# Altium project Sensors_and_MCU.PrjPcb
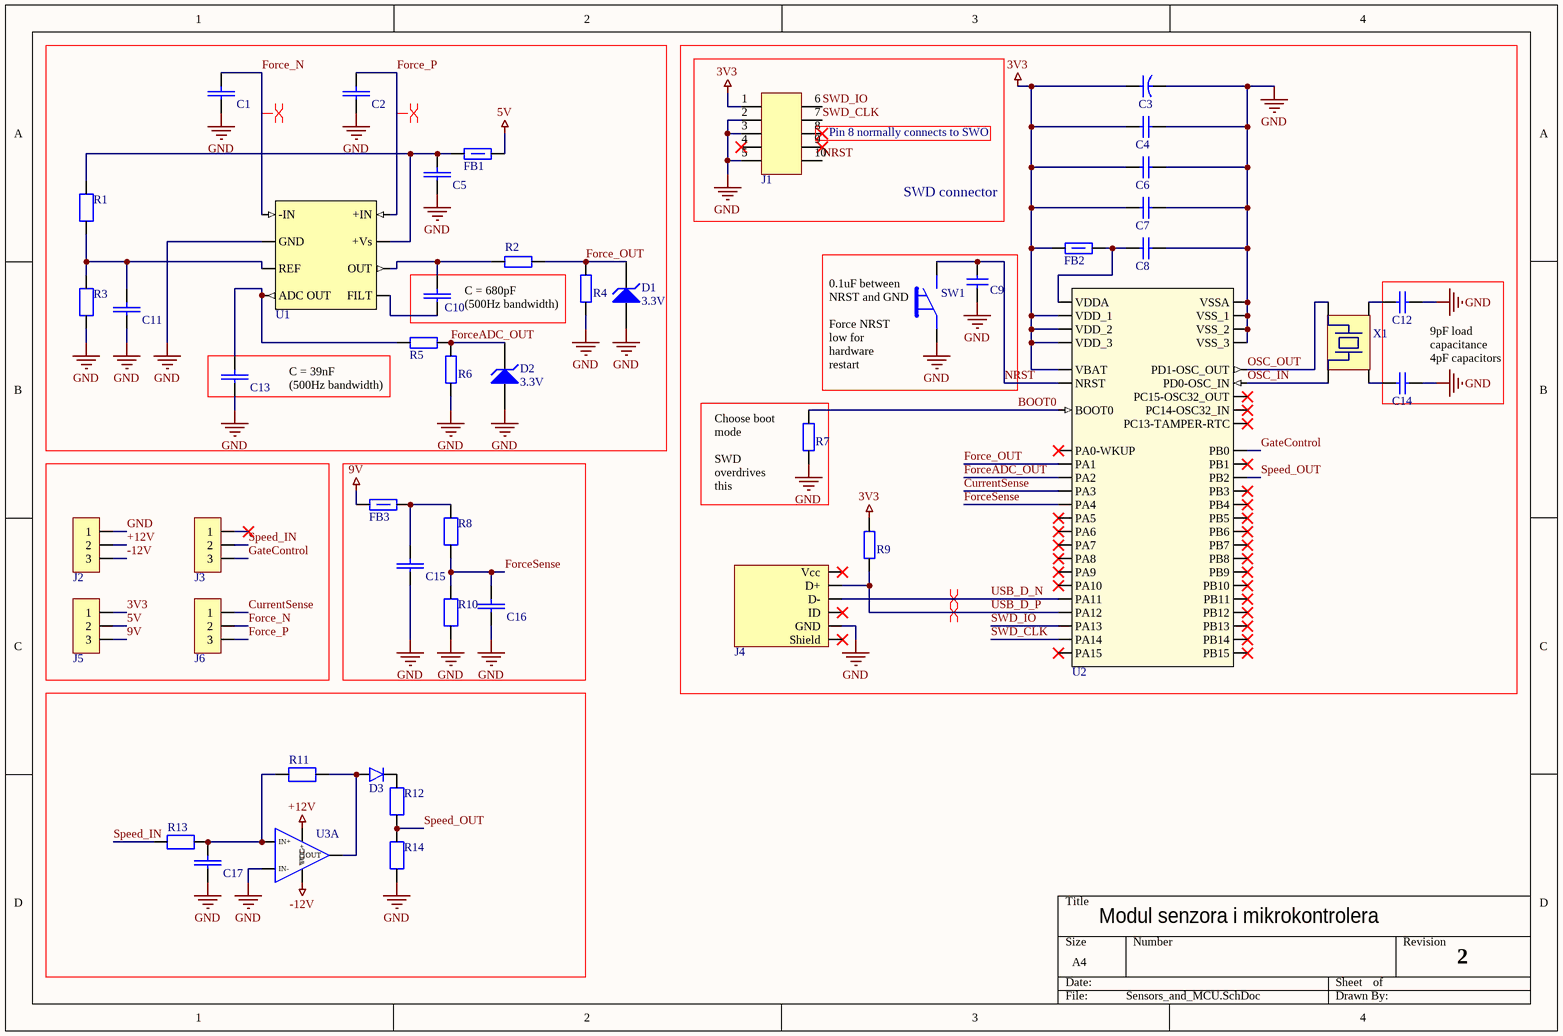
[diagram p0: Sensors_and_MCU.SchDoc]
1 sheet, 48 parts. Net scope: global (net labels, ports and power ports of the same name join across sheets).
Board file: Sensors_and_MCU.PcbDoc

## Sheet Sensors_and_MCU.SchDoc
size A4; SheetNumber: 1; SheetTotal: 1

### Parts
C1  Capacitor-NP  [C-NP]  (value not drawn)
C2  Capacitor-NP  [C-NP]  (value not drawn)
C3  10uF  [CAPAE430X610D540L170X65N]  (value not drawn)
C4  100nF  [CAPC160X80X87L35N]  (value not drawn)
C5  Capacitor-NP  [C-NP]  (value not drawn)
C6  100nF  [CAPC160X80X87L35N]  (value not drawn)
C7  100nF  [CAPC160X80X87L35N]  (value not drawn)
C8  100nF  [CAPC160X80X87L35N]  (value not drawn)
C9  100nF  [CAPC160X80X87L35N]  (value not drawn)
C10  Capacitor-NP  [C-NP]  (value not drawn)
C11  Capacitor-NP  [C-NP]  (value not drawn)
C12  4pF  [CAPC100X50X55L22N]  (value not drawn)
C13  Capacitor-NP  [C-NP]  (value not drawn)
C14  4pF  [CAPC100X50X55L22N]  (value not drawn)
C15  Capacitor-NP  [C-NP]  (value not drawn)
C16  Capacitor-NP  [C-NP]  (value not drawn)
C17  Capacitor-NP  [C-NP]  (value not drawn)
D1  BV: 3.3V  (hidden comment: Zener Diode)
D2  BV: 3.3V  (hidden comment: Zener Diode)
D3  Diode  [Diode]  (value not drawn)
FB1  BLM18HE152SH1D  [BEADC160X80X95L30N]  (value not drawn)
FB2  BLM18HE152SH1D  [BEADC160X80X95L30N]  (value not drawn)
FB3  BLM18HE152SH1D  [BEADC160X80X95L30N]  (value not drawn)
J1  Header_10P  [M50-3610542]  (value not drawn)
J2  Molex Micro-Latch  [ScrewTerminal]  (value not drawn)
J3  Molex Micro-Latch  [ScrewTerminal]  (value not drawn)
J4  USB  [USB_mini]  (value not drawn)
J5  Molex Micro-Latch  [ScrewTerminal]  (value not drawn)
J6  Molex Micro-Latch  [ScrewTerminal]  (value not drawn)
R1  100k  [R-2W]  (value not drawn)
R2  1.5k  [RESC160X80X50L30N]  (value not drawn)
R3  47k  [R-2W]  (value not drawn)
R4  1.5k  [RESC160X80X50L30N]  (value not drawn)
R5  1.5k  [RESC160X80X50L30N]  (value not drawn)
R6  1.5k  [RESC160X80X50L30N]  (value not drawn)
R7  1.5k  [RESC160X80X50L30N]  (value not drawn)
R8  200k  [R-2W]  (value not drawn)
R9  1.5k  [RESC160X80X50L30N]  (value not drawn)
R10  100k  [R-2W]  (value not drawn)
R11  220k  [R-2W]  (value not drawn)
R12  10k  [R-2W]  (value not drawn)
R13  1k  [R-2W]  (value not drawn)
R14  3.3k  [R-2W]  (value not drawn)
SW1  DTSM-62N-V-T/R  [DTSM62]  (value not drawn)
U1  AD8293G160ARJZ  [SOT23-8P65_280X145L45X30N]  (value not drawn)
U2  STM32F103CB  [QFP48P50_900X900X160L60X22N]  (value not drawn)
U3  RC4558P  [DIP1092W45P254L959H508Q8]  (value not drawn)  (part A of 2)
X1  16 MHz  [OSCCC320X250X60L90X110N]  (value not drawn)

### Blocks framed on the sheet
Pin 8 normally connects to SWO: C3 C4 C6-C9 C12 C14 FB2 J4 R7 R9 SW1 U2 X1
SWD connector: J1

### Nets
3V3: C3.1 C4.2 C6.2 C7.2 FB2.1 J1.1 J5.1 R9.2 U2.1(VBAT) U2.24(VDD_1) U2.36(VDD_2) U2.48(VDD_3)
5V: FB1.2 J5.2
9V: FB3.1 J5.3
+12V: J2.2 U3.8(VCC+)
-12V: J2.3 U3.4(VCC-)
GND: C1.1 C2.1 C3.2 C4.1 C5.1 C6.1 C7.1 C8.1 C9.2 C11.1 C12.1 C13.1 C14.1 C15.1 C16.1 C17.1 D1.1(A) D2.1(A) J1.2 J1.3 J1.5 J2.1 J4.5(GND) R3.1 R4.2 R6.2 R7.1 R10.1 R14.1 SW1.1 U1.2(GND) U2.8(VSSA) U2.23(VSS_1) U2.35(VSS_2) U2.47(VSS_3) U3.2(IN-)
BOOT0: R7.2 U2.44(BOOT0)
CurrentSense: J6.1 U2.13(PA3)
Force_N: C1.2 J6.2 U1.1(-IN)
Force_OUT: D1.2(K) R2.1 R4.1 U2.11(PA1)
Force_P: C2.2 J6.3 U1.8(+IN)
ForceADC_OUT: D2.2(K) R5.1 R6.1 U2.12(PA2)
ForceSense: C16.2 R8.1 R10.2 U2.14(PA4)
GateControl: J3.3 U2.18(PB0)
NRST: C9.1 J1.10 SW1.2 U2.7(NRST)
OSC_IN: U2.5(PD0-OSC_IN) X1.3
OSC_OUT: U2.6(PD1-OSC_OUT) X1.1
Speed_IN: J3.2 R13.2
Speed_OUT: R12.1 R14.2 U2.20(PB2)
SWD_CLK: J1.7 U2.37(PA14)
SWD_IO: J1.6 U2.34(PA13)
USB_D_N: J4.2(D-) U2.32(PA11)
USB_D_P: J4.3(D+) R9.1 U2.33(PA12)
NetC5_2: C5.2 FB1.1 R1.2 U1.7(+Vs)
NetC8_2: C8.2 FB2.2 U2.9(VDDA)
NetC10_1: C10.1 U1.5(FILT)
NetC10_2: C10.2 R2.2 U1.6(OUT)
NetC11_2: C11.2 R1.1 R3.2 U1.3(REF)
NetC12_2: C12.2 X1.2
NetC13_2: C13.2 R5.2 U1.4(ADC_OUT)
NetC14_2: C14.2 X1.4
NetC15_2: C15.2 FB3.2 R8.2
NetC17_2: C17.2 R11.2 R13.1 U3.3(IN+)
NetD3_A: D3.A R11.1 U3.1(OUT)
NetD3_C: D3.C R12.2

Not connected (* = marked no-connect by the designer): J1 4* 8* 9*; J3 1*; J4 1(Vcc)* 4(ID)* 6(Shield)*; U2 2(PC13-TAMPER-RTC)* 3(PC14-OSC32_IN)* 4(PC15-OSC32_OUT)* 10(PA0-WKUP)* 15(PA5)* 16(PA6)* 17(PA7)* 19(PB1)* 21(PB10)* 22(PB11)* 25(PB12)* 26(PB13)* 27(PB14)* 28(PB15)* 29(PA8)* 30(PA9)* 31(PA10)* 38(PA15)* 39(PB3)* 40(PB4)* 41(PB5)* 42(PB6)* 43(PB7)* 45(PB8)* 46(PB9)*

### Layout directives
differential pair: Force_N, Force_P, USB_D_N, USB_D_P

### Notes on the sheet
- C = 680pF
  (500Hz bandwidth)
- (near SW1) 0.1uF between NRST and GND
- (near R5) C = 39nF
  (500Hz bandwidth)
- (near SW1) Force NRST low for hardware restart
- 9pF load capacitance
  4pF capacitors
- (near R7) Choose boot mode
  SWD overdrives this
- Modul senzora i mikrokontrolera
- 2

### Library data of the parts
C1 C2 C11 C17 = Capacitor-NP: Value: 5nF
C3 = C_10uF_50V: Manufacturer Part Number: EEE-FK1H100SR; Voltage Rating: 50V; Capacitor Case Style: B; ComponentLinkDescription: Datasheet; FR_SN: C_P-01; Part Number: C_10uF_50V; Value: 10uF; ComponentLinkURL: https://hr.mouser.com/datasheet/2/315/ABA0000C1251-1138508.pdf; Supplier Part Number: 667-EEE-FK1H100SR
C4 C6-C9 = C_0603_100nF_50V: Manufacturer Part Number: CC0603MRY5V9BB104; Voltage Rating: 50V; Capacitor Case Style: 0603; ComponentLinkDescription: Datasheet; FR_SN: C_NP-02; Part Number: C_0603_100nF_50V; Value: 100nF; ComponentLinkURL: https://hr.mouser.com/datasheet/2/212/KEM_C1027_X7; Supplier Part Number: 603-C0603MRY5V9BB104
C5 C15 C16 = Capacitor-NP: Value: 100nF
C10 = Capacitor-NP: Value: 680pF
C12 C14 = C_0402_4pF_25V: Manufacturer Part Number: GRM0225C1E4R0CA03L; Voltage Rating: 25V; Capacitor Case Style: 0402; ComponentLinkDescription: Datasheet; FR_SN: C_NP-69; Part Number: C_0402_4pF_25V; Value: 4pF; ComponentLinkURL: https://hr.mouser.com/datasheet/2/281/GRM0225C1E4R; Supplier Part Number: 81-GRM0225C1E4R0CA3L
C13 = Capacitor-NP: Value: 39nF
D1 D2 = Zener Diode: AF: 1; BV_MAX: 1e99; CJO: 0; EG: 1.11; FC: 0.5; IBV: 0.001; IS: 1e-14; MJSW: 0.33; NTUN: 30; TNOM: 27; XTI: 3; SimulationGenericComponent: True; CJP: 0; CTA: 0; CTP: 0; FCS: 0.5; FV_MAX: 1e99; IKF: 0; IKR: 0; ISR: 1e-14; JSW: 0; JTUN: 0; JTUNSW: 0; KEG: 1; KF: 0; LEVEL: 1; N: 1; NBV: 1; NR: 1; NS: 1; PHP: 1; RS: 0; TCV: 0; TLEV: 0; TLEVC: 0; TM1: 0; TM2: 0; TPB: 0; TPHP: 0; TRS: 0; TRS2: 0; TT: 0; TTT1: 0; TTT2: 0; VJ: 1; XTITUN: 3
FB1-FB3 = BLM18HE152SH1D: DC Current Rating: 500 mA; Inductor Case Style: 0603; ComponentLinkDescription: Datasheet; FR_SN: FB-04; Part Number: BLM18HE152SH1D; Value: BLM18HE152SH1D; Manufacturer Part Number: BLM18HE152SH1D; ComponentLinkURL: https://hr.mouser.com/datasheet/2/281/QNFA9104-1915632.pdf; Supplier Part Number: 81-BLM18HE152SH1D
J1 = Header_2x5: ComponentLinkDescription: Datasheet; FR_SN: J-18; Part Number: Header_2x5; Value: Header_10P; Manufacturer Part Number: M50-3610542; ComponentLinkURL: https://hr.mouser.com/datasheet/2/181/M50-361-888037.pdf; Supplier Part Number: 855-M50-3610542
J2 J3 J5 J6 = Molex Micro-Latch 1x3: Manufacturer Part Number: 53254-0370; ComponentLinkDescription: Datasheet; FR_SN: J-13; Part Number: Molex Micro-Latch 1x3; Value: Molex Micro-Latch; ComponentLinkURL: https://hr.mouser.com/datasheet/2/276/0532540370_PCB_HEADERS-171041.pdf; Supplier Part Number: 538-53254-0370
J4 = USB mini: Manufacturer Part Number: UJ2-MBH-1-SMT-TR; ComponentLinkDescription: Datasheet; FR_SN: J-03; Part Number: USB mini; Value: USB; ComponentLinkURL: https://hr.mouser.com/datasheet/2/670/uj2-mbh-smt-1313286.pdf; Supplier Part Number: 490-UJ2-MBH-1-SMT
R1 R3 R8 R10-R14 = Resistor
  R1 R10: Value: 100k
  R3: Value: 47k
  R8: Value: 200k
  R11: Value: 220k
  R12: Value: 10k
  R13: Value: 1k
  R14: Value: 3.3k
R2 R4-R7 R9 = R_0603_1k5_0W1: Manufacturer Part Number: RT0603FRE101K5L; Power Rating: 100mW; Resistor Case Style: 0603; Temperature Coefficient: 50 PPM / C; FR_SN: R-118; Part Number: R_0603_1k5_0W1; Value: 1.5k; ComponentLink1URL: https://hr.mouser.com/datasheet/2/447/PYu_RT_1_to_0_01_RoHS_L_12-3003070.pdf; ComponentLink1Description: Datasheet; Supplier Part Number: 603-RT0603FRE101K5L
SW1 = DTSM-62N-V-T/R: Switch Case Style: SMD; Configuration: SPST; ComponentLinkDescription: Datasheet; FR_SN: SW-12; Part Number: DTSM-62N-V-T/R; Value: DTSM-62N-V-T/R; Type: Tactile Switch; Manufacturer Part Number: DTSM-62N-V-T/R; ComponentLinkURL: https://www.mouser.com/datasheet/2/910/464_DTSMJ_6-1571536.pdf; Supplier Part Number: 113-DTSM-62N-V-T/R
U1 = AD8293G160ARJZ: Manufacturer Part Number: AD8293G160ARJZ-R7; IC Case Style: SOT-23-8; ComponentLinkDescription: Datasheet; FR_SN: U_Analog-17; Part Number: AD8293G160ARJZ; Value: AD8293G160ARJZ; Category: Instrumentation Amplifier; ComponentLinkURL: https://hr.mouser.com/datasheet/2/609/AD8293G80_160-877846.pdf; Supplier Part Number: 584-AD8293G160ARJZR7
U2 = STM32F103CB: Manufacturer Part Number: STM32F103CBT6; IC Case Style: LQFP-48; ComponentLinkDescription: Datasheet; FR_SN: MCU-11; Part Number: STM32F103CB; Value: STM32F103CB; Category: ARM Microcontrollers; ComponentLinkURL: https://hr.mouser.com/datasheet/2/389/stm32f103c8-1851025.pdf; Supplier Part Number: 511-STM32F103CBT6
U3 = RC4558P: IC Case Style: DIP-8; ComponentLinkDescription: Datasheet; FR_SN: U_Analog-16; Part Number: RC4558P; Value: RC4558P; Category: Dual Chanel OP Amp; Manufacturer Part Number: RC4558P; ComponentLinkURL: https://www.ti.com/lit/ds/symlink/rc4558.pdf?HQS=dis-mous-null-mousermode-dsf-pf-null-wwe&ts=1651672561225&ref_url=https%253A%252F%252Fwww.mouser.pl%252F; Supplier Part Number: 595-RC4558P
X1 = X_16MHZ_9pF: Manufacturer Part Number: TSX-3225 16.0000MF09Z-AC3; Frequency Tolerance: 10 PPM; Frequency: 16MHz; ComponentLinkDescription: Datasheet; FR_SN: X-09; Part Number: X_16MHZ_9pF; Value: 16 MHz; ComponentLinkURL: https://hr.mouser.com/datasheet/2/137/A-238_en-932914.pdf; Supplier Part Number: 732-TX325-16F09Z-AC3